# EAGLE design Programmer Board (EAGLE 9.4.2)
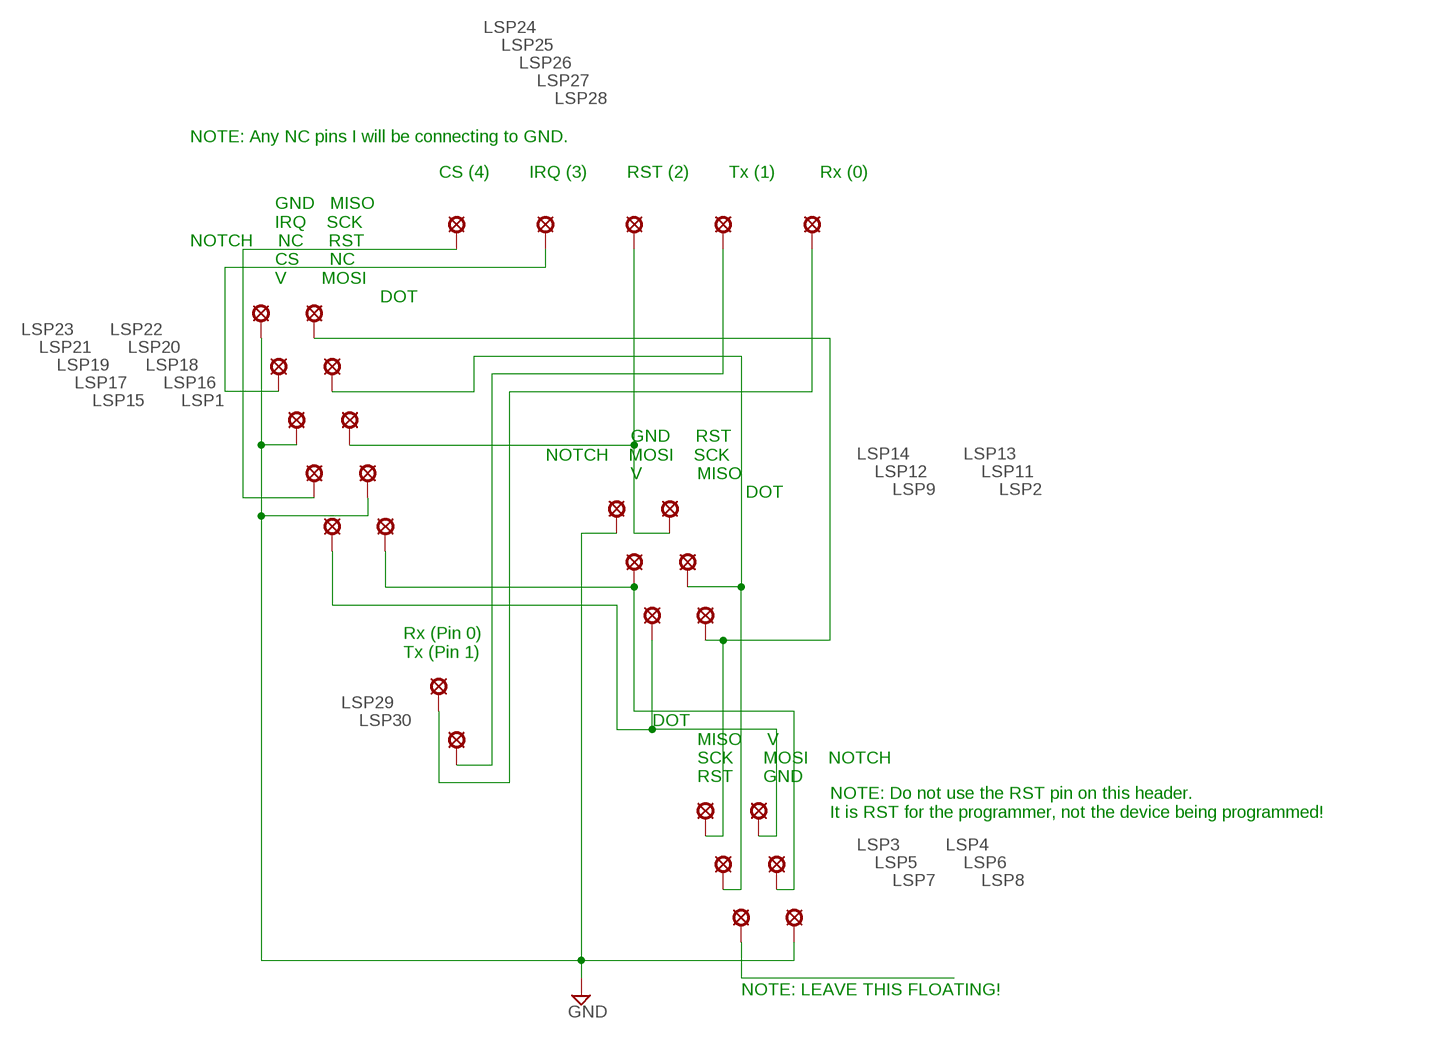
[diagram p0: schematic, sheet 1]

## Parts
LSP1  LSP10_S  [LSP10_S]
LSP2  LSP10_S  [LSP10_S]
LSP3  LSP10_S  [LSP10_S]
LSP4  LSP10_CLSP10_C  [LSP10_C]
LSP5  LSP10_CLSP10_C  [LSP10_C]
LSP6  LSP10_CLSP10_C  [LSP10_C]
LSP7  LSP10_CLSP10_C  [LSP10_C]
LSP8  LSP10_CLSP10_C  [LSP10_C]
LSP9  LSP10_CLSP10_C  [LSP10_C]
LSP11  LSP10_CLSP10_C  [LSP10_C]
LSP12  LSP10_CLSP10_C  [LSP10_C]
LSP13  LSP10_CLSP10_C  [LSP10_C]
LSP14  LSP10_CLSP10_C  [LSP10_C]
LSP15  LSP10_CLSP10_C  [LSP10_C]
LSP16  LSP10_CLSP10_C  [LSP10_C]
LSP17  LSP10_CLSP10_C  [LSP10_C]
LSP18  LSP10_CLSP10_C  [LSP10_C]
LSP19  LSP10_CLSP10_C  [LSP10_C]
LSP20  LSP10_CLSP10_C  [LSP10_C]
LSP21  LSP10_CLSP10_C  [LSP10_C]
LSP22  LSP10_CLSP10_C  [LSP10_C]
LSP23  LSP10_CLSP10_C  [LSP10_C]
LSP24  LSP10_CLSP10_C  [LSP10_C]
LSP25  LSP10_CLSP10_C  [LSP10_C]
LSP26  LSP10_CLSP10_C  [LSP10_C]
LSP27  LSP10_CLSP10_C  [LSP10_C]
LSP28  LSP10_S  [LSP10_S]
LSP29  LSP10_S  [LSP10_S]
LSP30  LSP10_CLSP10_C  [LSP10_C]

## Nets
GND: LSP8.P$1(MP) LSP14.P$1(MP) LSP16.P$1(MP) LSP19.P$1(MP) LSP23.P$1(MP)
N$1: LSP5.P$1(MP) LSP11.P$1(MP) LSP20.P$1(MP)
N$2: LSP27.P$1(MP) LSP30.P$1(MP)
N$3: LSP28.P$1(MP) LSP29.P$1(MP)
N$4: LSP1.P$1(MP) LSP6.P$1(MP) LSP12.P$1(MP)
N$5: LSP2.P$1(MP) LSP3.P$1(MP) LSP22.P$1(MP)
N$6: LSP4.P$1(MP) LSP9.P$1(MP) LSP15.P$1(MP)
N$7: LSP7.P$1(MP)
N$10: LSP17.P$1(MP) LSP24.P$1(MP)
N$11: LSP21.P$1(MP) LSP25.P$1(MP)
N$12: LSP13.P$1(MP) LSP18.P$1(MP) LSP26.P$1(MP)

## Notes on the sheet
- NOTE: Any NC pins I will be connecting to GND.
- CS (4)        IRQ (3)        RST (2)        Tx (1)         Rx (0)
- GND   MISO
                   IRQ    SCK
  NOTCH     NC     RST
                   CS      NC
                   V       MOSI
                                        DOT
- GND     RST
  NOTCH    MOSI    SCK
                   V           MISO
                                          DOT
- Rx (Pin 0)
  Tx (Pin 1)
- DOT
           MISO     V
           SCK      MOSI    NOTCH
           RST      GND
- NOTE: Do not use the RST pin on this header.
  It is RST for the programmer, not the device being programmed!
- NOTE: LEAVE THIS FLOATING!

## Library data of the parts
LSP1-LSP3 LSP28 LSP29 = tbtaco-solpad:LSP10_S: SOLDER PAD drill 1.0 mm, distributor Buerklin, 12H555
LSP4-LSP9 LSP11-LSP27 LSP30 = tbtaco-solpad:LSP10_C: SOLDER PAD drill 1.0 mm, distributor Buerklin, 12H555

## Board
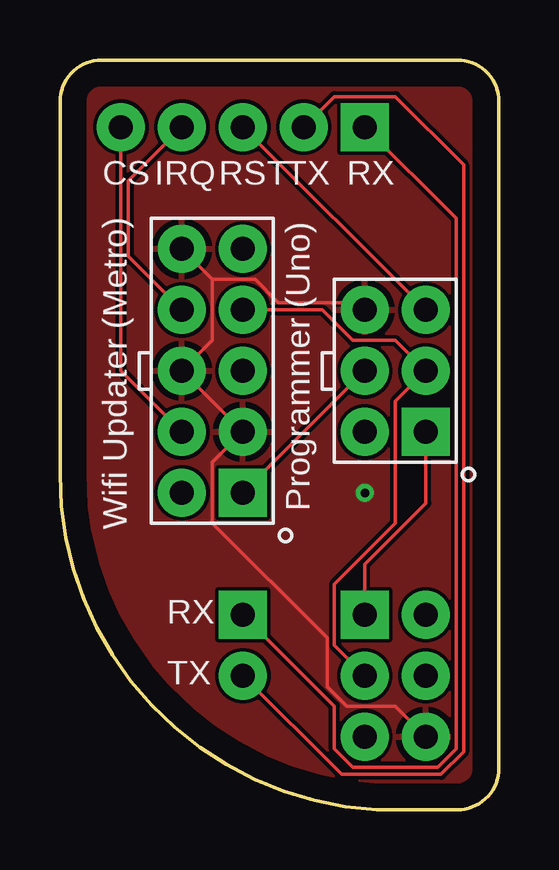
[diagram p1: board, top side]
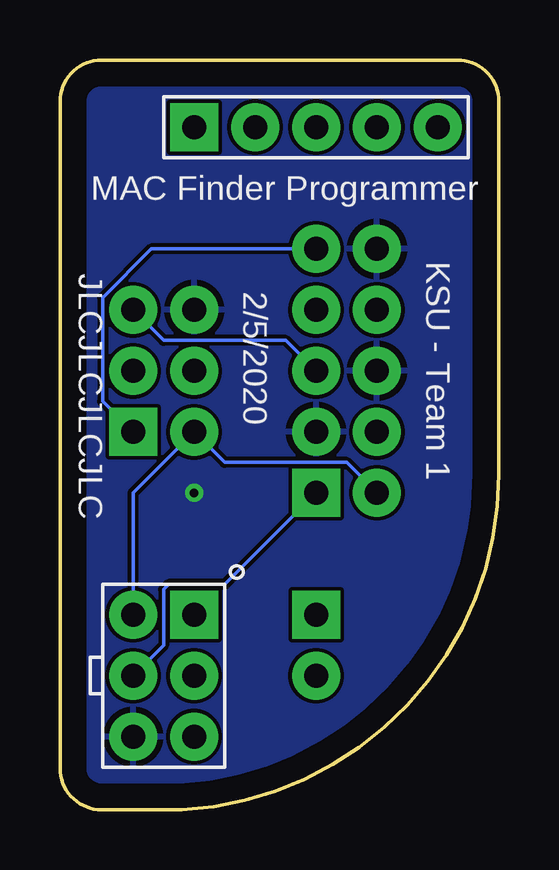
[diagram p2: board, bottom side, seen from below]

Size 18.29 x 31.24 mm. Coordinates in mm from the lower left corner, seen from the top.
Outline: 1.73,31.24 16.55,31.24 arc-90 18.29,29.51 18.29,1.73 arc-90 16.55,0 13.21,0 arc-87 0,13.97 0,29.51 arc-90 1.73,31.24
Copper layers (1*16): Top 0.035mm / dielectric 1.5mm / Bottom 0.035mm
Design rules "default": minimum track width 6mil, minimum drill 0.35mm, track to track 6mil, track to pad 6mil, pad to pad 6mil, via to via 6mil, smd to smd 6mil, copper to edge 40mil, drill to drill 6mil, minimum pad ring 10mil, minimum via ring 8mil, stop-mask expansion 4mil, vias tented up to drill 0mil, thermal gap 10mil

### Footprints (pad centres in the part's own frame; a part is rotated, then mirrored left to right if it is on the bottom)
LSP10_S = drill 1 pad 2 square: P$1 0,0
LSP10_C = drill 1 pad 2: P$1 0,0

### Placement (x,y rotation side)
LSP1  7.62,13.21 0 top
LSP2  15.24,15.75 0 top
LSP3  12.7,8.13 0 top
LSP4  15.24,8.13 0 top
LSP5  12.7,5.59 0 top
LSP6  15.24,5.59 0 top
LSP7  12.7,3.05 0 top
LSP8  15.24,3.05 0 top
LSP9  12.7,15.75 0 top
LSP11  15.24,18.29 0 top
LSP12  12.7,18.29 0 top
LSP13  15.24,20.83 0 top
LSP14  12.7,20.83 0 top
LSP15  5.08,13.21 0 top
LSP16  7.62,15.75 0 top
LSP17  5.08,15.75 0 top
LSP18  7.62,18.29 0 top
LSP19  5.08,18.29 0 top
LSP20  7.62,20.83 0 top
LSP21  5.08,20.83 0 top
LSP22  7.62,23.37 0 top
LSP23  5.08,23.37 0 top
LSP24  2.54,28.45 0 top
LSP25  5.08,28.45 0 top
LSP26  7.62,28.45 0 top
LSP27  10.16,28.45 0 top
LSP28  12.7,28.45 0 top
LSP29  7.62,8.13 0 top
LSP30  7.62,5.59 0 top

### Tracks (layer width: path | path; a pad name or v marks a point on that pad's centre or on a via)
GND  (via drill 0.35)
  Top 0.152: LSP23.P$1 6.35,22.1 | 6.35,22.1 6.35,19.56 LSP19.P$1 LSP16.P$1 6.35,14.48 6.35,11.94 11.12,7.16 11.12,5.13 11.94,4.32 13.97,4.32 LSP8.P$1 | LSP14.P$1 12.4,21.13 9.09,21.13 8.13,22.1 6.35,22.1
  other vias: 12.7,13.21
  pour Top: 0,31.24 18.29,31.24 18.29,0 2.03,0 0.25,0 0,0 0,16
  pour Bottom: 18.29,31.24 0,31.24 0,0 18.29,0
N$1
  Top 0.152: LSP20.P$1 10.92,20.83 12.19,19.56 13.97,19.56 LSP11.P$1 13.97,17.02 13.97,11.94 11.43,9.4 11.43,6.86 LSP5.P$1
N$2
  Top 0.152: LSP27.P$1 11.43,29.72 13.97,29.72 16.81,26.87 16.81,2.41 15.87,1.47 11.73,1.47 LSP30.P$1
N$3
  Top 0.152: LSP28.P$1 16.51,24.64 16.51,2.54 15.75,1.78 12.19,1.78 11.43,2.54 11.43,4.32 LSP29.P$1
N$4
  Top 0.152: LSP1.P$1 LSP12.P$1
  Bottom 0.152: LSP1.P$1 11.43,9.4 13.75,9.4 13.97,9.18 13.97,6.86 LSP6.P$1
N$5
  Top 0.152: LSP3.P$1 12.7,10.24 15.24,12.78 LSP2.P$1
  Bottom 0.152: LSP22.P$1 14.48,23.37 16.51,21.34 16.51,17.02 LSP2.P$1
N$6
  Bottom 0.152: LSP15.P$1 6.35,14.48 11.43,14.48 LSP9.P$1 15.24,13.21 LSP4.P$1
N$10
  Top 0.152: LSP24.P$1 2.54,18.29 LSP17.P$1
N$11
  Top 0.152: LSP25.P$1 2.84,26.21 2.84,23.06 LSP21.P$1
N$12
  Top 0.152: LSP26.P$1 LSP13.P$1
  Bottom 0.152: LSP18.P$1 8.89,19.56 13.97,19.56 LSP13.P$1

### Text on the board
tPlace: CS | IRQ | RST | TX | RX | Programmer (Uno) | Wifi Updater (Metro) | RX | TX
bPlace: MAC Finder Programmer | KSU - Team 1 | 2/5/2020 | JLCJLCJLCJLC